# Altium schematic sheet Cover.SchDoc: MCP33151-10 Eval Board
size B; DrawnBy: Jasper Yun; SheetNumber: 1; SheetTotal: 11; Competition: SAC 2021; Subteam: Avionics; University: McGill University; Location: Montreal, Quebec; Project: Avionics Project Name; MRT: McGill Rocket Team
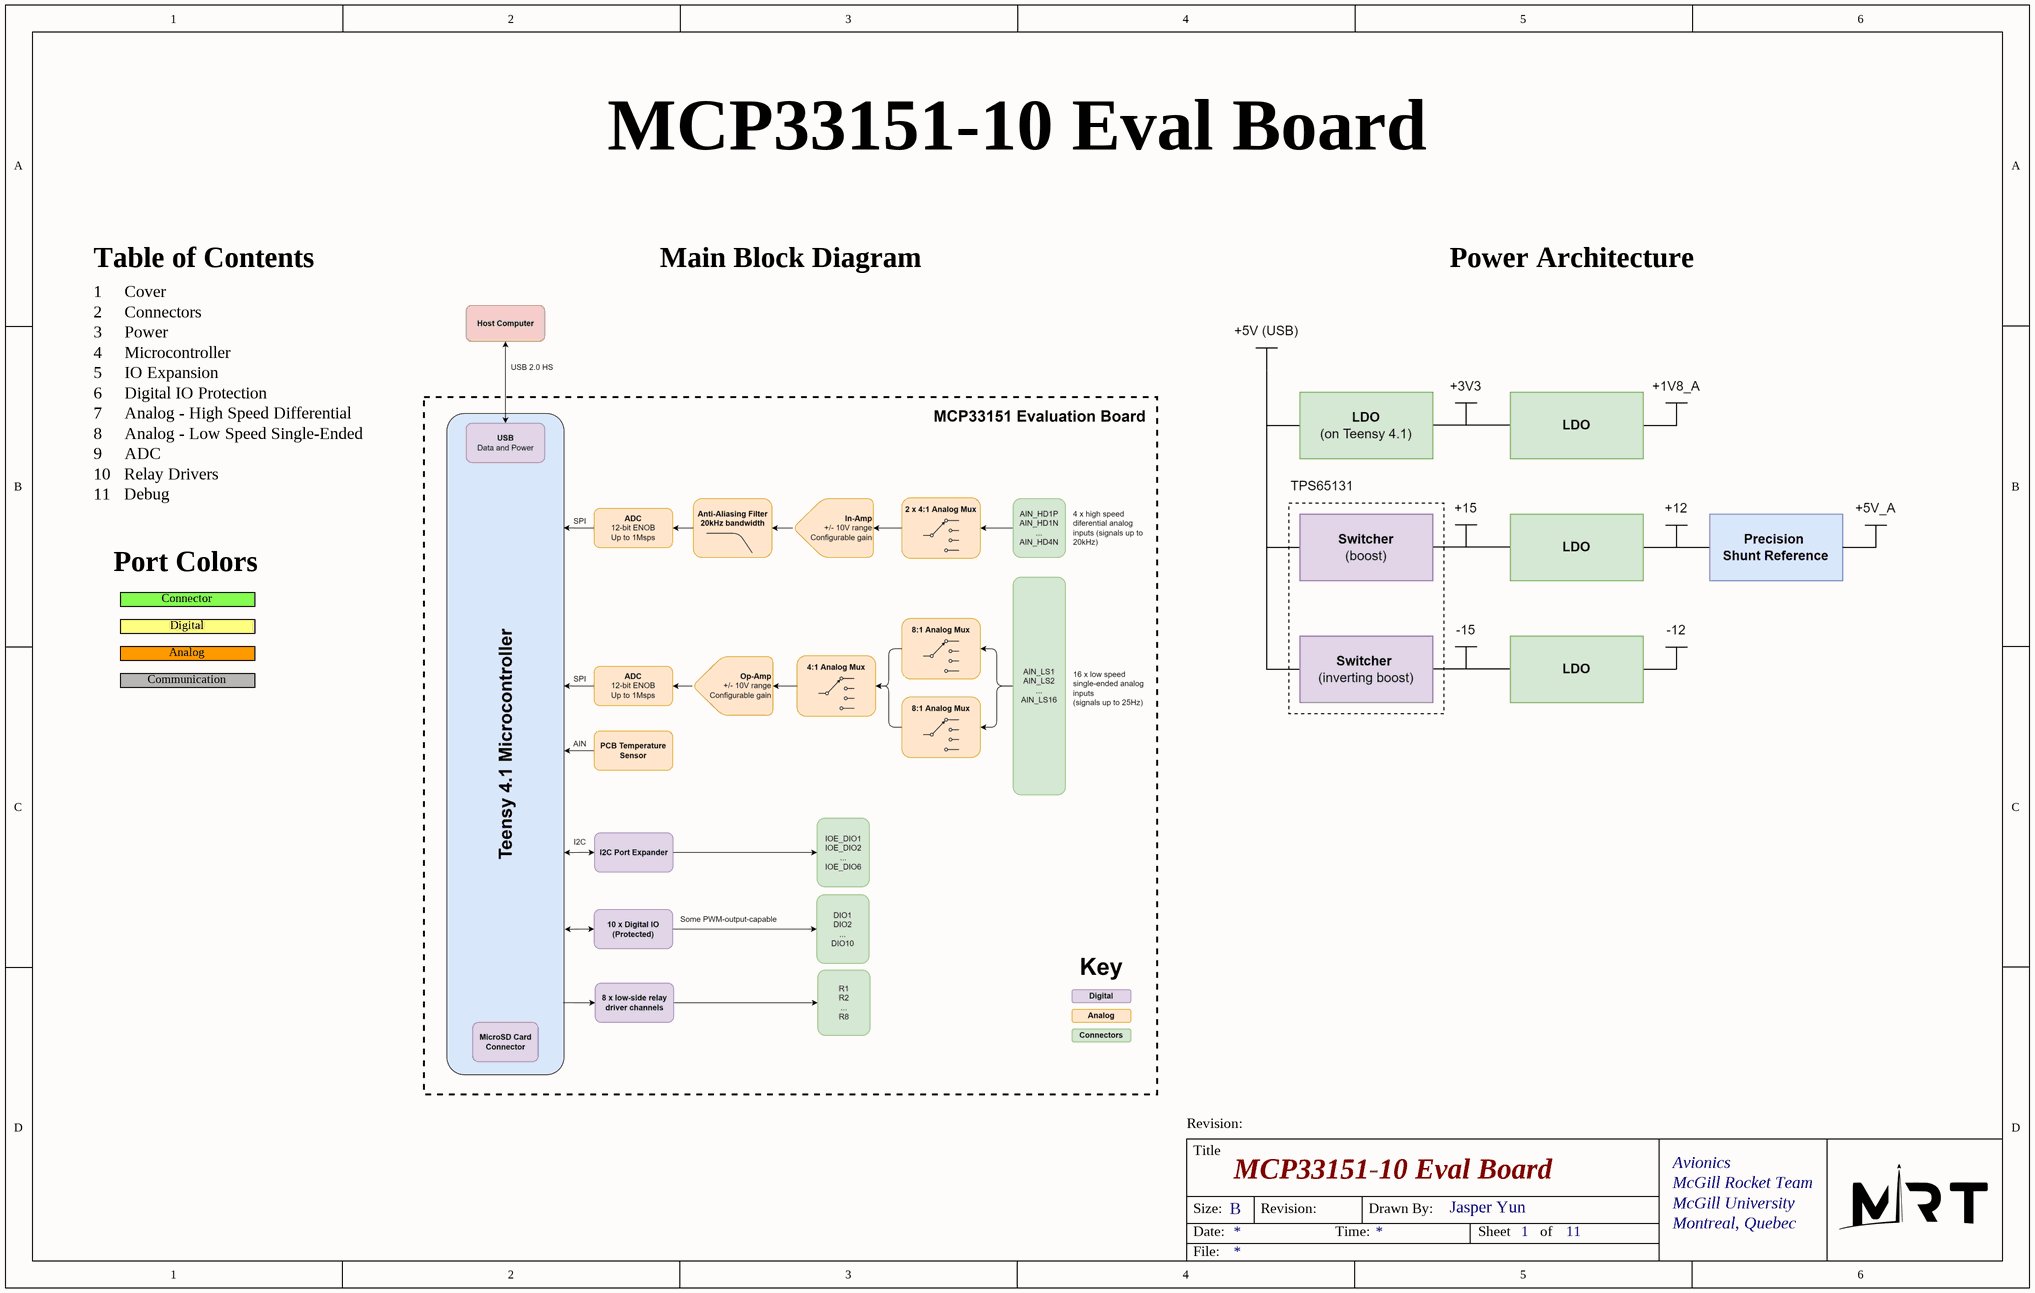
[diagram p0: Cover.SchDoc]

## Notes on the sheet
- Table of Contents
- 1     Cover
- Main Block Diagram
- Power Architecture
- 2     Connectors
- 3     Power
- 4     Microcontroller
- 5     IO Expansion
- 6     Digital IO Protection
- 7     Analog - High Speed Differential
- 8     Analog - Low Speed Single-Ended
- 9     ADC
- 10   Relay Drivers
- 11   Debug
- Port Colors
- Connector
- Digital
- Analog
- Communication
- Title
- Size:
- Date:
- B
- Revision:
- Time:
- Drawn By:
- Sheet
- of
- File: